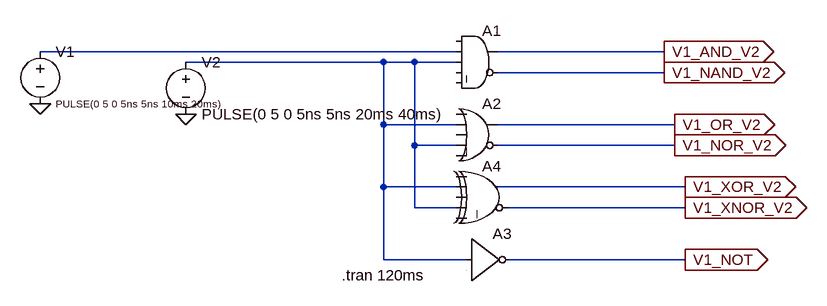
[diagram p0: schematic Draft1.asc]
Draft1.asc, the LTspice schematic file:
Version 4.1
SHEET 1 880 680
WIRE -128 -80 -768 -80
WIRE 192 -80 -64 -80
WIRE -240 -64 -544 -64
WIRE -192 -64 -240 -64
WIRE -128 -64 -192 -64
WIRE 192 -48 -64 -48
WIRE -240 32 -240 -64
WIRE -128 32 -240 32
WIRE 208 32 -64 32
WIRE -192 64 -192 -64
WIRE -128 64 -192 64
WIRE 208 64 -64 64
WIRE -240 128 -240 32
WIRE -128 128 -240 128
WIRE 224 128 -64 128
WIRE -192 160 -192 64
WIRE -128 160 -192 160
WIRE 224 160 -48 160
WIRE -240 240 -240 128
WIRE -112 240 -240 240
WIRE 224 240 -48 240
FLAG -768 0 0
FLAG 192 -80 V1_AND_V2
IOPIN 192 -80 Out
FLAG 208 32 V1_OR_V2
IOPIN 208 32 Out
FLAG 208 64 V1_NOR_V2
IOPIN 208 64 Out
FLAG 224 128 V1_XOR_V2
IOPIN 224 128 Out
FLAG 224 160 V1_XNOR_V2
IOPIN 224 160 Out
FLAG 224 240 V1_NOT
IOPIN 224 240 Out
FLAG 192 -48 V1_NAND_V2
IOPIN 192 -48 Out
FLAG -544 16 0
SYMBOL Digital\\and -96 -128 R0
SYMATTR InstName A1
SYMBOL Digital\\or -96 -16 R0
SYMATTR InstName A2
SYMBOL Digital\\inv -112 176 R0
SYMATTR InstName A3
SYMBOL Digital\\xor -80 80 R0
SYMATTR InstName A4
SYMBOL voltage -768 -96 R0
WINDOW 3 24 96 Left 1
WINDOW 123 0 0 Left 0
WINDOW 39 0 0 Left 0
SYMATTR InstName V1
SYMATTR Value PULSE(0 5 0 5ns 5ns 10ms 20ms)
SYMBOL voltage -544 -80 R0
WINDOW 123 0 0 Left 0
WINDOW 39 0 0 Left 0
SYMATTR InstName V2
SYMATTR Value PULSE(0 5 0 5ns 5ns 20ms 40ms)
TEXT -304 264 Left 2 !.tran 120ms

The netlist it stands for:
* Draft1.asc
A1 0 N001 N002 0 0 V1_NAND_V2 V1_AND_V2 0 AND
A2 0 N002 0 N002 0 V1_NOR_V2 V1_OR_V2 0 OR
A3 N002 0 0 0 0 V1_NOT 0 0 BUF
A4 0 N002 0 N002 0 V1_XNOR_V2 V1_XOR_V2 0 XOR
V1 N001 0 PULSE(0 5 0 5ns 5ns 10ms 20ms)
V2 N002 0 PULSE(0 5 0 5ns 5ns 20ms 40ms)
.tran 120ms
.backanno
.end